# Altium schematic sheet Audio.SchDoc: TEBF0808 - Audio
size A4; Organization: Trenz Electronic GmbH; DocumentNumber: TEBF0808; Revision: 04; SheetNumber: 12; SheetTotal: 36; Date: 2016-09-29; CompanyName: Trenz Electronic GmbH
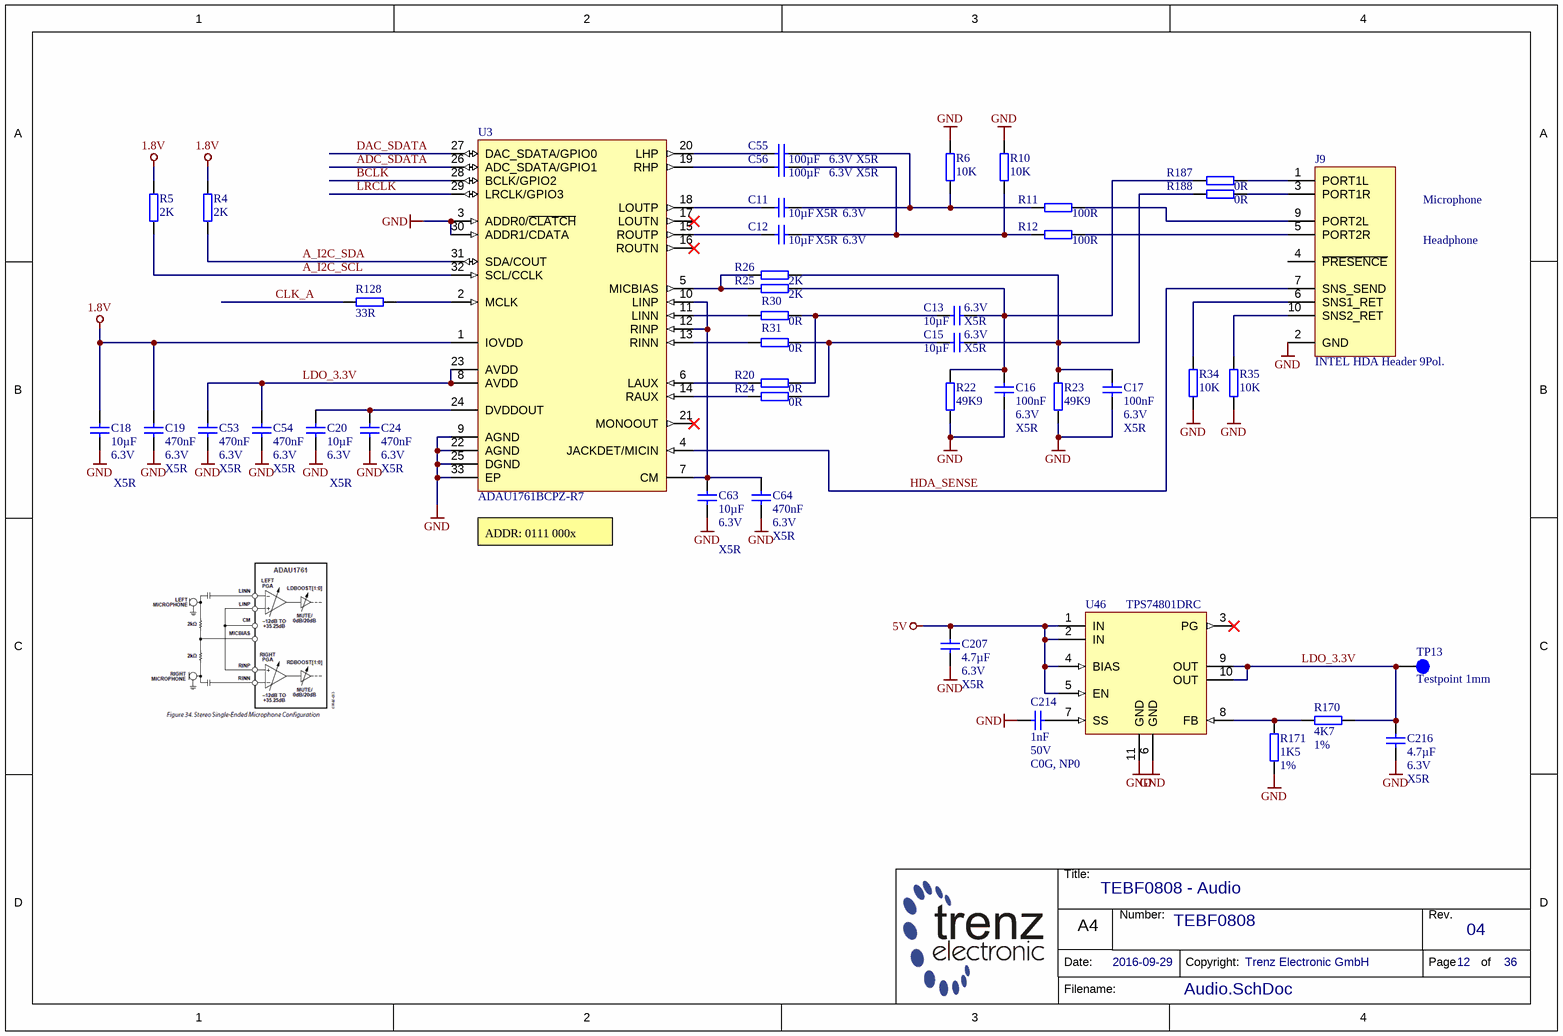
[diagram p0: Audio.SchDoc]

## Parts
C11  10µF  Voltage: 6.3V  Technology: X5R  [CAPC1608X90N]
C12  10µF  Voltage: 6.3V  Technology: X5R  [CAPC1608X90N]
C13  10µF  Voltage: 6.3V  Technology: X5R  [CAPC1608X90N]
C15  10µF  Voltage: 6.3V  Technology: X5R  [CAPC1608X90N]
C16  100nF  Voltage: 6.3V  Technology: X5R  [CAPC0603X33N]
C17  100nF  Voltage: 6.3V  Technology: X5R  [CAPC0603X33N]
C18  10µF  Voltage: 6.3V  Technology: X5R  [CAPC1608X90N]
C19  470nF  Voltage: 6.3V  Technology: X5R  [CAPC1005X55N]
C20  10µF  Voltage: 6.3V  Technology: X5R  [CAPC1608X90N]
C24  470nF  Voltage: 6.3V  Technology: X5R  [CAPC1005X55N]
C53  470nF  Voltage: 6.3V  Technology: X5R  [CAPC1005X55N]
C54  470nF  Voltage: 6.3V  Technology: X5R  [CAPC1005X55N]
C55  100µF  Voltage: 6.3V  Technology: X5R  [CAPC3216X180N]
C56  100µF  Voltage: 6.3V  Technology: X5R  [CAPC3216X180N]
C63  10µF  Voltage: 6.3V  Technology: X5R  [CAPC1608X90N]
C64  470nF  Voltage: 6.3V  Technology: X5R  [CAPC1005X55N]
C207  4.7µF  Voltage: 6.3V  Technology: X5R  [CAPC1005X60N]
C214  1nF  Voltage: 50V  Technology: C0G, NP0  [CAPC1005X55N]
C216  4.7µF  Voltage: 6.3V  Technology: X5R  [CAPC1005X60N]
J9  INTEL HDA Header 9Pol.  [INTEL_FP_HDA_9PIN]
R4  2K  [RESC1005X40N]
R5  2K  [RESC1005X40N]
R6  10K  [RESC1005X40N]
R10  10K  [RESC1005X40N]
R11  100R  [RESC1005X40N]
R12  100R  [RESC1005X40N]
R20  0R  [RESC1005X40N]
R22  49K9  [RESC1005X40N]
R23  49K9  [RESC1005X40N]
R24  0R  [RESC1005X40N]
R25  2K  [RESC1005X40N]
R26  2K  [RESC1005X40N]
R30  0R  [RESC1005X40N]
R31  0R  [RESC1005X40N]
R34  10K  [RESC1005X40N]
R35  10K  [RESC1005X40N]
R128  33R  [RESC1005X40N]
R170  4K7  Tolerance: 1%  [RESC1005X40N]
R171  1K5  Tolerance: 1%  [RESC1005X40N]
R187  0R  [RESC1005X40N]
R188  0R  [RESC1005X40N]
TP13  Testpoint 1mm  [TP_1mm]
U3  ADAU1761BCPZ-R7  [QFN50P500X500X100-33N]
U46  TPS74801DRC  [SON50P300X300X100-11N-TI]

## Nets
1.8V: C18.1 C19.1 R4.2 R5.2 U3.1(IOVDD)
5V: C207.1 U46.1(IN) U46.2(IN) U46.4(BIAS) U46.5(EN)
GND: C16.1 C17.1 C18.2 C19.2 C20.2 C24.2 C53.2 C54.2 C63.2 C64.2 C207.2 C214.1 C216.2 J9.2(GND) R6.1 R10.1 R22.2 R23.2 R34.1 R35.1 R171.2 U3.3(ADDR0/~{CLATCH}) U3.9(AGND) U3.22(AGND) U3.25(DGND) U3.30(ADDR1/CDATA) U3.33(EP) U46.6(GND) U46.11(GND)
A_I2C_SCL: R5.1 U3.32(SCL/CCLK)
A_I2C_SDA: R4.1 U3.31(SDA/COUT)
ADC_SDATA: U3.26(ADC_SDATA/GPIO1)
BCLK: U3.28(BCLK/GPIO2)
CLK_A: R128.1
DAC_SDATA: U3.27(DAC_SDATA/GPIO0)
HDA_SENSE: J9.7(SNS_SEND) U3.4(JACKDET/MICIN)
LDO_3.3V: C53.1 C54.1 C216.1 R170.2 TP13.1 U3.8(AVDD) U3.23(AVDD) U46.9(OUT) U46.10(OUT)
LRCLK: U3.29(LRCLK/GPIO3)
NetC11_1: C11.1 U3.18(LOUTP)
NetC11_2: C11.2 C55.2 R6.2 R11.1
NetC12_1: C12.1 U3.15(ROUTP)
NetC12_2: C12.2 C56.2 R10.2 R12.1
NetC13_1: C13.1 R20.1 R30.1
NetC13_2: C13.2 C16.2 R22.1 R25.2 R187.2
NetC15_1: C15.1 R24.1 R31.1
NetC15_2: C15.2 C17.2 R23.1 R26.2 R188.2
NetC20_1: C20.1 C24.1 U3.24(DVDDOUT)
NetC55_1: C55.1 U3.20(LHP)
NetC56_1: C56.1 U3.19(RHP)
NetC63_1: C63.1 C64.1 U3.7(CM) U3.10(LINP) U3.12(RINP)
NetC214_2: C214.2 U46.7(SS)
NetJ9_1: J9.1(PORT1L) R187.1
NetJ9_3: J9.3(PORT1R) R188.1
NetJ9_5: J9.5(PORT2R) R12.2
NetJ9_6: J9.6(SNS1_RET) R34.2
NetJ9_9: J9.9(PORT2L) R11.2
NetJ9_10: J9.10(SNS2_RET) R35.2
NetR20_2: R20.2 U3.6(LAUX)
NetR24_2: R24.2 U3.14(RAUX)
NetR25_1: R25.1 R26.1 U3.5(MICBIAS)
NetR30_2: R30.2 U3.11(LINN)
NetR31_2: R31.2 U3.13(RINN)
NetR128_2: R128.2 U3.2(MCLK)
NetR170_1: R170.1 R171.1 U46.8(FB)

Not connected (* = marked no-connect by the designer): J9 4(~{PRESENCE}); U3 16(ROUTN)* 17(LOUTN)* 21(MONOOUT)*; U46 3(PG)*

## Notes on the sheet
- Microphone
- Headphone
- (near U3) ADDR: 0111 000x
- Title:
- Number:
- Rev.
- Date:
- A4
- Copyright:
- Page
- of
- Filename:

## Library data of the parts
C11-C13 C15 C18 C20 C63 = 22918: KON 10µF 6,3V X5R SMD; AN: 22918; Mixed: SMT; Value: 10u; Case: 1608 (0603)
C16 C17 = 24915: KON 100nF 6.3V X5R SMD 10%; AN: 24915; Mixed: SMT; Value: 100n; Preferred: Yes; Case: 0603 (0201); Tolerance: 10%
C19 C24 C53 C54 C64 = 23659: KON 470nF 6,3V X5R SMD; AN: 23659; Value: 470n; Mixed: SMT; Preferred: Yes; Case: 1005 (0402)
C55 C56 = 23116: KON 100µF 6,3V X5R SMD 20%; AN: 23116; Mixed: SMT; Value: 100u; Preferred: Yes; Case: 3216 (1206); Tolerance: 20%
C207 C216 = 24719: KON 4.7µF 6.3V X5R SMD 20%; AN: 24719; Mixed: SMT; Value: 4.7u; Preferred: Yes; Case: 1005 (0402); Tolerance: 20%
C214 = 23752: KON 1nF NP0 SMD 5%; AN: 23752; Mixed: SMT; Value: 1n; Case: 1005 (0402); Tolerance: 5%
J9 = 27249: Stiftleiste Intel HDA Header 9polig; AN: 27249; Mixed: THT; Trenz-Stock: Yes; HelpURL: B:\AD\adlib\datasheet\INTEL_FP_CON
R4 R5 R25 R26 = 25073: WID SMD 2K 1% 0,063W; AN: 25073; Mixed: SMT; Tolerance: 1%; Case: 1005 (0402); Technology: TK100; Value: 2K
R6 R10 R34 R35 = 22750: WID SMD 10K 1% 0,063W; AN: 22750; Mixed: SMT; Preferred: Yes; Tolerance: 1%; Case: 1005 (0402); Technology: TK100; Value: 10K
R11 R12 = 22507: WID SMD 100R 1% 0,063W; AN: 22507; Mixed: SMT; Value: 100; Preferred: Yes; Tolerance: 1%; Case: 1005 (0402); Technology: TK100
R20 R24 R30 R31 R187 R188 = 22738: WID SMD 0R; AN: 22738; Tolerance: 1%; Mixed: SMT; Value: 0; Preferred: Yes; Case: 1005 (0402); Technology: TK100
R22 R23 = 24677: WID SMD 49K9 1% 0,063W; AN: 24677; Mixed: SMT; Value: 49.9K; Preferred: Yes; Tolerance: 1%; Case: 1005 (0402); Technology: TK100
R128 = 22770: WID SMD 33R 1% 0,063W; AN: 22770; Mixed: SMT; Value: 33; Preferred: Yes; Tolerance: 1%; Case: 1005 (0402); Technology: TK100
R170 = 22585: WID SMD 4K7 1% 0,063W; AN: 22585; Mixed: SMT; Value: 4.7K; Preferred: Yes; Case: 1005 (0402); Technology: TK100
R171 = 22602: WID SMD 1K5 1% 0,063W; AN: 22602; Mixed: SMT; Value: 1.5K; Preferred: Yes; Case: 1005 (0402); Technology: TK100
TP13 = 25063: AN: 25063; Mixed: SMT
U3 = 27279: AN: 27279; Mixed: SMT; Trenz-Stock: Yes; Case: LFCSP32; HelpURL: B:\\AD\adlib\datasheet\ADAU1761; H-ART: ADAU1761BCPZ-R7
U46 = 25235: AN: 25235; Mixed: SMT; Trenz-Stock: Yes; Case: DRC (S-PVSON-N10); HelpURL: B:\AD\adlib\datasheet\TPS74801; H-ART: TPS74801DRC